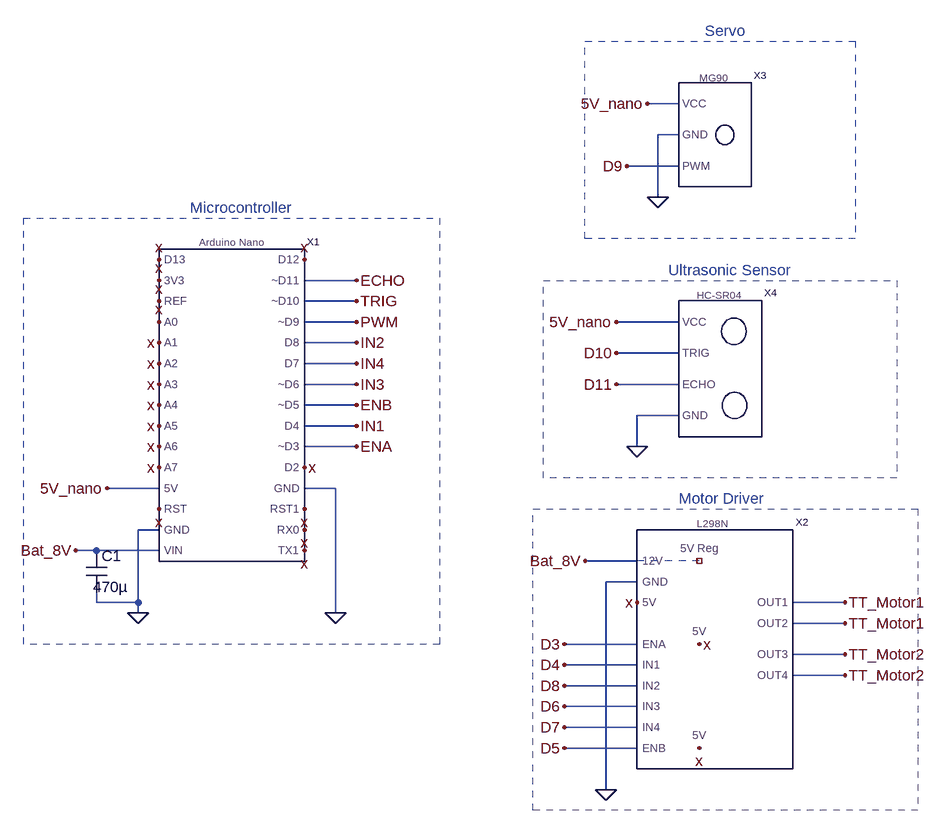
[diagram p0: schematic rover_schematic.asc]
rover_schematic.asc, the LTspice schematic file:
Version 4.1
SHEET 1 1300 720
WIRE 880 -432 832 -432
WIRE 880 -384 848 -384
WIRE 880 -336 800 -336
WIRE 848 -288 848 -384
WIRE 384 -160 304 -160
WIRE 384 -128 304 -128
WIRE 384 -96 304 -96
WIRE 880 -96 784 -96
WIRE 384 -64 304 -64
WIRE 880 -48 784 -48
WIRE 384 -32 304 -32
WIRE 384 0 304 0
WIRE 880 0 784 0
WIRE 384 32 304 32
WIRE 880 48 816 48
WIRE 384 64 304 64
WIRE 384 96 304 96
WIRE 816 96 816 48
WIRE 80 160 0 160
WIRE 352 160 304 160
WIRE 80 224 48 224
WIRE -16 256 -48 256
WIRE 80 256 -16 256
WIRE 816 272 736 272
WIRE 816 304 768 304
WIRE -16 336 -16 320
WIRE 48 336 48 224
WIRE 48 336 -16 336
WIRE 1136 336 1056 336
WIRE 48 352 48 336
WIRE 352 352 352 160
WIRE 1136 368 1056 368
WIRE 816 400 704 400
WIRE 1136 416 1056 416
WIRE 816 432 704 432
WIRE 1136 448 1056 448
WIRE 816 464 704 464
WIRE 816 496 704 496
WIRE 816 528 704 528
WIRE 816 560 704 560
WIRE 768 624 768 304
FLAG -48 256 Bat_8V
FLAG 0 160 5V_nano
FLAG 784 -96 5V_nano
FLAG 784 -48 D10
FLAG 784 0 D11
FLAG 768 624 0
FLAG 352 352 0
FLAG 48 352 0
FLAG 832 -432 5V_nano
FLAG 800 -336 D9
FLAG 816 96 0
FLAG 848 -288 0
FLAG 736 272 Bat_8V
FLAG 704 400 D3
FLAG 704 432 D4
FLAG 704 560 D5
FLAG 704 496 D6
FLAG 704 528 D7
FLAG 704 464 D8
FLAG 1136 336 TT_Motor1
FLAG 1136 368 TT_Motor1
FLAG 1136 416 TT_Motor2
FLAG 1136 448 TT_Motor2
FLAG 384 96 ENA
FLAG 384 64 IN1
FLAG 384 -64 IN2
FLAG 384 0 IN3
FLAG 384 -32 IN4
FLAG 384 32 ENB
FLAG 384 -96 PWM
FLAG 384 -128 TRIG
FLAG 384 -160 ECHO
FLAG 80 128 x
FLAG 80 192 x
FLAG 80 96 x
FLAG 80 64 x
FLAG 80 32 x
FLAG 80 0 x
FLAG 80 -32 x
FLAG 80 -64 x
FLAG 80 -96 x
FLAG 80 -128 x
FLAG 80 -160 x
FLAG 80 -192 x
FLAG 304 -192 x
FLAG 304 128 x
FLAG 304 192 x
FLAG 304 224 x
FLAG 304 256 x
FLAG 816 336 x
FLAG 912 400 x
FLAG 912 560 x
SYMBOL symbols\\arduino_nano 128 224 R0
SYMATTR InstName X1
SYMBOL symbols\\l298n 592 384 R0
SYMATTR InstName X2
SYMBOL symbols\\servoMotor 912 -384 R0
SYMATTR InstName X3
SYMBOL symbols\\ultrasonicSensor 960 32 R0
SYMATTR InstName X4
SYMBOL cap -32 256 R0
WINDOW 3 65 56 Right 2
SYMATTR InstName C1
SYMATTR Value 470µ
TEXT 920 -544 Left 2 ;Servo
TEXT 864 -176 Left 2 ;Ultrasonic Sensor
TEXT 880 176 Left 2 ;Motor Driver
TEXT 128 -272 Left 2 ;Microcontroller
LINE Normal 912 272 816 272 2
RECTANGLE Normal 1152 -224 736 -528 2
RECTANGLE Normal 1216 144 672 -160 2
RECTANGLE Normal 1248 656 656 192 2
RECTANGLE Normal 512 400 -128 -256 2

The netlist it stands for:
* rover_schematic.asc
X§X1 Bat_8V 0 x 5V_nano x x x x x x x x x x x x x x 0 x ENA IN1 ENB IN3 IN4 IN2 PWM TRIG ECHO x arduino_nano  ; pins VIN GND RST 5V A7 A6 A5 A4 A3 A2 A1 A0 REF 3V3 D13 TX1 RX0 RST1 GND D2 ~D3 D4 ~D5 ~D6 D7 D8 ~D9 ~D10 ~D11 D12
X§X2 TT_Motor1 Bat_8V 0 x NC_01 D3 D4 D8 D6 D7 D5 x x TT_Motor1 TT_Motor2 TT_Motor2 l298n  ; pins OUT1 12V GND 5V 5V_Reg ENA IN1 IN2 IN3 IN4 ENB 5V 5V OUT2 OUT3 OUT4
X§X3 5V_nano 0 D9 servoMotor  ; pins VCC GND PWM
X§X4 5V_nano D10 D11 0 ultrasonicSensor  ; pins VCC TRIG ECHO GND
C1 Bat_8V 0 470µ
* Servo
* Ultrasonic Sensor
* Motor Driver
* Microcontroller
.backanno
.end